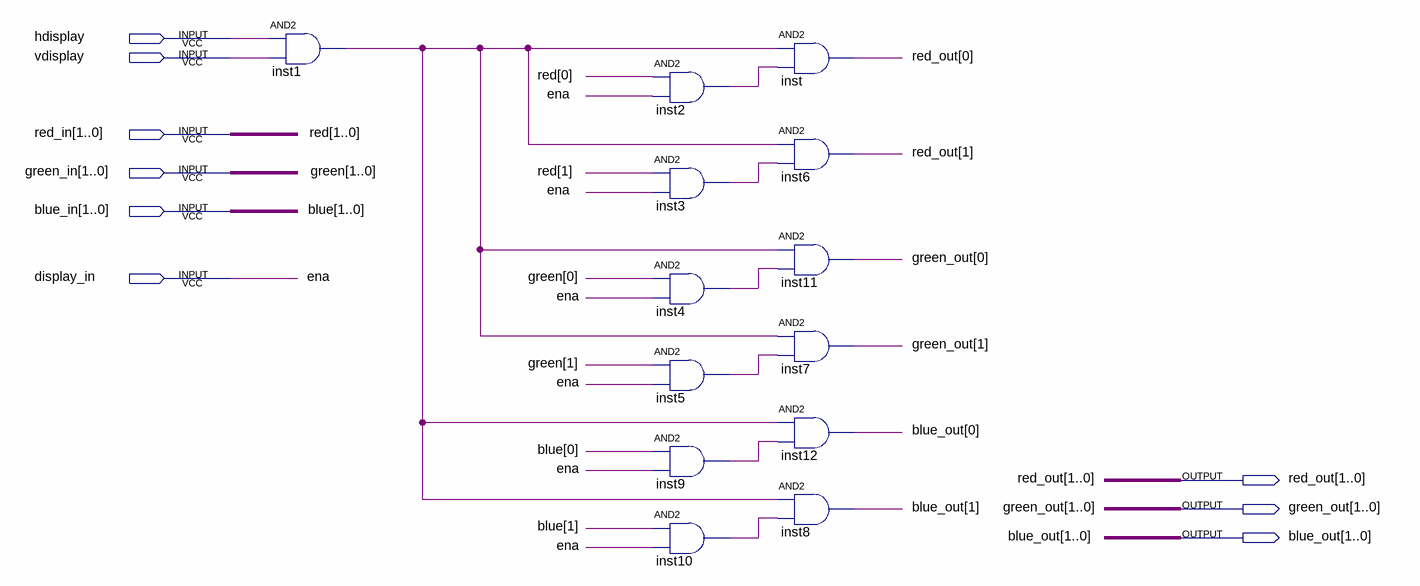
[diagram p0: schematic sheet]
// Quartus schematic color_mux.bdf as structural Verilog: 13 symbols, 9 pins
module color_mux (
  input  hdisplay,
  input  vdisplay,
  input  [1:0] red_in,
  input  [1:0] green_in,
  input  [1:0] blue_in,
  input  display_in,
  output [1:0] red_out,
  output [1:0] green_out,
  output [1:0] blue_out
);

  wire inst1_out, inst2_out, inst3_out, inst4_out, inst5_out, inst9_out, inst10_out;

  and inst1 (inst1_out, hdisplay, vdisplay);
  and inst2 (inst2_out, red_in[0], display_in);
  and inst3 (inst3_out, red_in[1], display_in);
  and inst4 (inst4_out, green_in[0], display_in);
  and inst5 (inst5_out, green_in[1], display_in);
  and inst9 (inst9_out, blue_in[0], display_in);
  and inst10 (inst10_out, blue_in[1], display_in);
  and inst (red_out[0], inst1_out, inst2_out);
  and inst6 (red_out[1], inst1_out, inst3_out);
  and inst11 (green_out[0], inst1_out, inst4_out);
  and inst7 (green_out[1], inst1_out, inst5_out);
  and inst12 (blue_out[0], inst1_out, inst9_out);
  and inst8 (blue_out[1], inst1_out, inst10_out);

  // Other names for the same wires on the sheet: blue[1:0] = blue_in; ena = display_in; green[1:0] = green_in;
  //   red[1:0] = red_in
endmodule
